# Altium schematic sheet 28Pins_schematic.SchDoc (part 2 of 2)
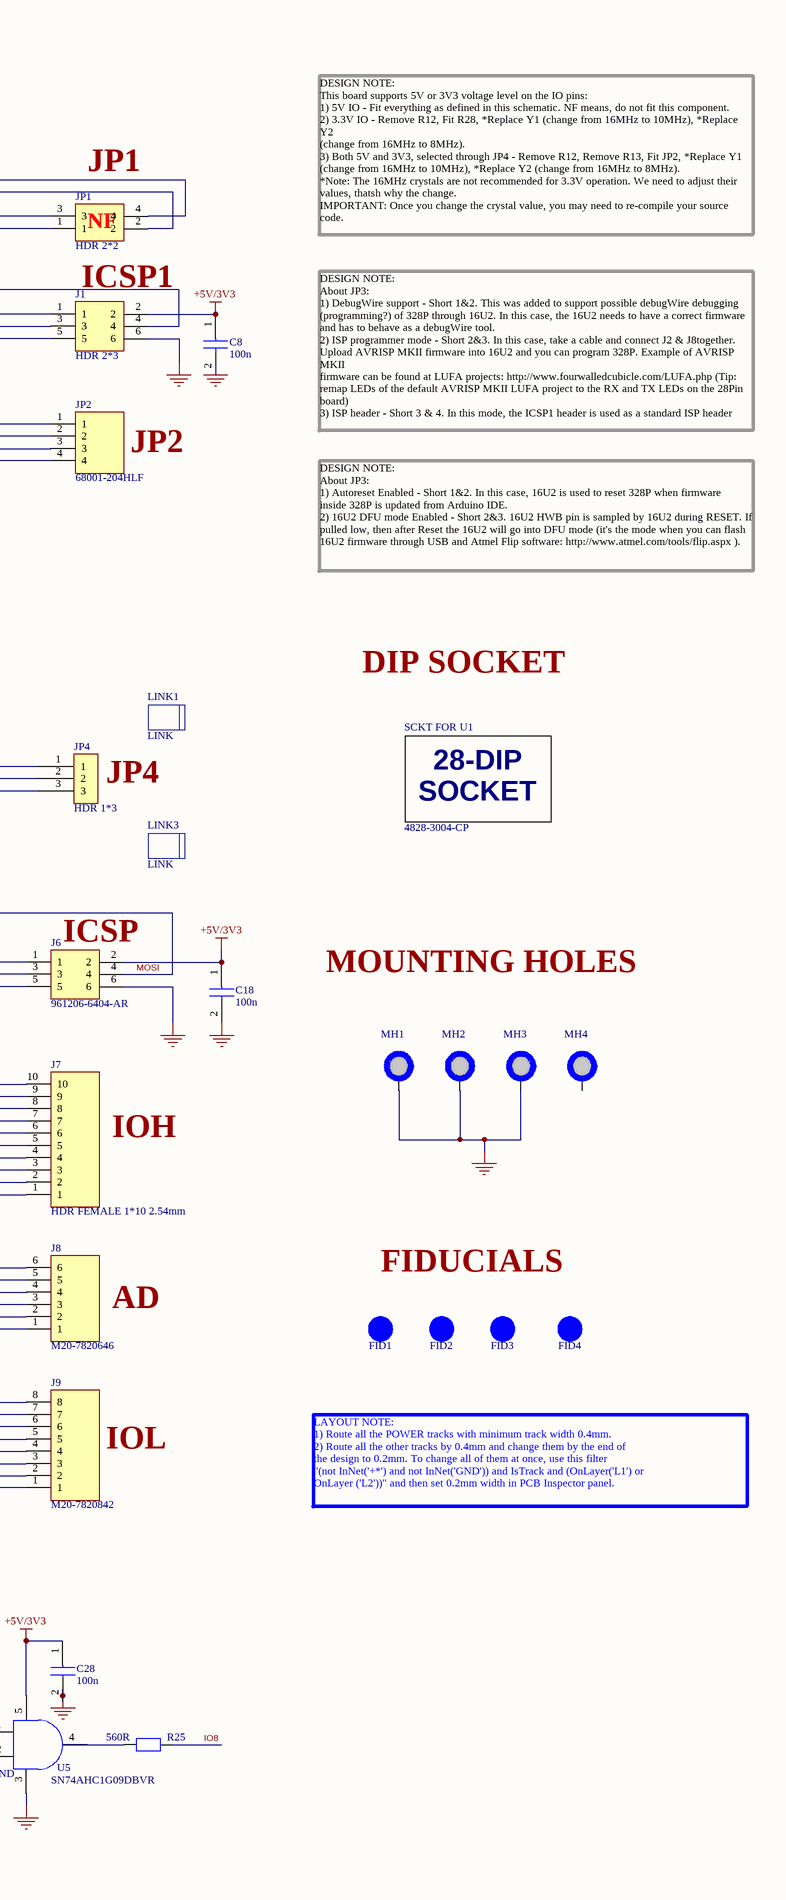
[diagram p2: 28Pins_schematic.SchDoc, right]

## Library data of the parts
C1 C15-C17 C19 C21 C22 = C2012X5R1C106M125AC: 10 µF ±20% 16V Ceramic Capacitor X5R 0805 (2012 Metric); Manufacturer_Name: TDK; Datasheet Link: https://product.tdk.com/info/en/catalog/datasheets/mlcc_commercial_midvoltage_en.pdf; Height: 1.45mm; Manufacturer_Part_Number: C2012X5R1C106M125AC; Mouser Part Number: 810-C2012X5R1C106M-3; Mouser Price/Stock: https://www.mouser.co.uk/ProductDetail/TDK/C2012X5R1C106M125AC?qs=LcTL%2F5vFEzHcq9TBdtOIgw%3D%3D
C2-C4 C8 C11-C14 C18 C20 C23-C25 C28-C33 = C2012X7R1H104K_085AA_: Capacitor; Manufacturer_Name: TDK; Manufacturer_Part_Number: C2012X7R1H104K(085AA); Datasheet Link: https://product.tdk.com/info/en/catalog/datasheets/mlcc_commercial_midvoltage_en.pdf; Height: 1.45mm
C5 = C2012X5R1E105K125AA: C Series 0805 1 uF 25 V ±10% Tolerance X5R SMT Multilayer Ceramic Capacitor; Manufacturer: TDK; Manufacturer Lifecycle Status: PRODUCTION; Capacitance: 1µF; Voltage: 25V; Supplier 1: DigiKey; Manufacturer Part Number: C2012X5R1E105K125AA; RoHS: Compliant; Category: Ceramic Capacitors; Stock 1: 10349; Pricing 1: 1=0.19, 10=0.106, 50=0.0756, 100=0.0662, 500=0.05034, 1000=0.04546 (USD); Case/Package: 0805; Case Code (Imperial): 0805; Case Code (Metric): 2012; China RoHS: Compliant; Composition: Ceramic; Depth: 1.25mm; Dielectric: X5R; Dielectric Material: Ceramic; Height: 1.25mm; Lead Free: Lead Free; Length: 2mm; Lifecycle Status: Production; Material: Ceramic; Max Length: 2.2mm; Max Operating Temperature: 85°C; Max Width: 1.45mm; Min Length: 1.8mm; Min Operating Temperature: -55°C; Min Width: 1.05mm; Mount: Surface Mount; Number of Pins: 2; Number of Terminals: 2; Radiation Hardening: No; REACH SVHC: Yes; Schedule B: 8532240020, 8532240020|8532240020, 8532240020|8532240020|8532240020, 8532240020|8532240020|8532240020|8532240020; Termination: SMD/SMT; Tolerance: 10%; Voltage Rating: 25V; Voltage Rating (DC): 25V; Weight: 5.499807mg; Width: 1.25mm; ComponentLink1URL: https://datasheet.octopart.com:443/C2012X5R1E105K125AA-TDK-datasheet-175423548.pdf?src-supplier=TME; ComponentLink1Description: https://datasheet.octopart.com:443/C2012X5R1E105K125AA-TDK-datasheet-175423548.pdf?src-supplier=TME; ComponentLink2URL: https://datasheet.octopart.com:443/C2012X5R1E105K125AA-TDK-datasheet-182135025.pdf?src-supplier=TME; ComponentLink2Description: https://datasheet.octopart.com:443/C2012X5R1E105K125AA-TDK-datasheet-182135025.pdf?src-supplier=TME; ComponentLink3URL: https://datasheet.octopart.com:443/C2012X5R1E105K125AA-TDK-datasheet-159617022.pdf?src-supplier=TME; ComponentLink3Description: https://datasheet.octopart.com:443/C2012X5R1E105K125AA-TDK-datasheet-159617022.pdf?src-supplier=TME; ComponentLink4URL: https://datasheet.octopart.com:443/C2012X5R1E105K125AA-TDK-datasheet-151546523.pdf?src-supplier=TDK; ComponentLink4Description: https://datasheet.octopart.com:443/C2012X5R1E105K125AA-TDK-datasheet-151546523.pdf?src-supplier=TDK; ComponentLink5URL: https://datasheet.octopart.com/C2012X5R1E105K125AA-TDK-datasheet-41194876.pdf; ComponentLink5Description: https://datasheet.octopart.com/C2012X5R1E105K125AA-TDK-datasheet-41194876.pdf; ComponentLink6URL: https://datasheet.octopart.com:443/C2012X5R1E105K125AA-TDK-datasheet-20681607.pdf?src-supplier=Newark; ComponentLink6Description: https://datasheet.octopart.com:443/C2012X5R1E105K125AA-TDK-datasheet-20681607.pdf?src-supplier=Newark; ComponentLink7URL: https://datasheet.octopart.com:443/C2012X5R1E105K125AA-TDK-datasheet-82475248.pdf?src-supplier=Newark; ComponentLink7Description: https://datasheet.octopart.com:443/C2012X5R1E105K125AA-TDK-datasheet-82475248.pdf?src-supplier=Newark; ComponentLink8URL: https://datasheet.octopart.com:443/C2012X5R1E105K125AA-TDK-datasheet-8852320.pdf?src-supplier=Newark; ComponentLink8Description: https://datasheet.octopart.com:443/C2012X5R1E105K125AA-TDK-datasheet-8852320.pdf?src-supplier=Newark; ComponentLink9URL: https://datasheet.octopart.com:443/C2012X5R1E105K125AA-TDK-datasheet-13376850.pdf?src-supplier=Newark; ComponentLink9Description: https://datasheet.octopart.com:443/C2012X5R1E105K125AA-TDK-datasheet-13376850.pdf?src-supplier=Newark; ComponentLink10URL: https://datasheet.octopart.com:443/C2012X5R1E105K125AA-TDK-datasheet-10921857.pdf?src-supplier=element14+APAC; ComponentLink10Description: https://datasheet.octopart.com:443/C2012X5R1E105K125AA-TDK-datasheet-10921857.pdf?src-supplier=element14+APAC; ComponentLink11URL: https://datasheet.octopart.com:443/C2012X5R1E105K125AA-TDK-datasheet-12509848.pdf?src-supplier=Future+Electronics; ComponentLink11Description: https://datasheet.octopart.com:443/C2012X5R1E105K125AA-TDK-datasheet-12509848.pdf?src-supplier=Future+Electronics; ComponentLink12URL: https://datasheet.octopart.com:443/C2012X5R1E105K125AA-TDK-datasheet-10978788.pdf?src-supplier=Future+Electronics; ComponentLink12Description: https://datasheet.octopart.com:443/C2012X5R1E105K125AA-TDK-datasheet-10978788.pdf?src-supplier=Future+Electronics; ComponentLink13URL: https://datasheet.octopart.com:443/C2012X5R1E105K125AA-TDK-datasheet-8359770.pdf?src-supplier=Future+Electronics; ComponentLink13Description: https://datasheet.octopart.com:443/C2012X5R1E105K125AA-TDK-datasheet-8359770.pdf?src-supplier=Future+Electronics; ComponentLink14URL: https://datasheet.octopart.com:443/C2012X5R1E105K125AA-TDK-datasheet-8324322.pdf?src-supplier=Future+Electronics; ComponentLink14Description: https://datasheet.octopart.com:443/C2012X5R1E105K125AA-TDK-datasheet-8324322.pdf?src-supplier=Future+Electronics; ComponentLink15URL: https://datasheet.octopart.com:443/C2012X5R1E105K125AA-TDK-datasheet-128946.pdf?src-supplier=Future+Electronics; ComponentLink15Description: https://datasheet.octopart.com:443/C2012X5R1E105K125AA-TDK-datasheet-128946.pdf?src-supplier=Future+Electronics; Supplier Part Number 1: 445-1419-1-ND
C6 C7 = EEE-1AA101WR: Radial Can - SMD ALUMINUM ELECTROLYTIC CAPACITOR S 10V 100muF ±20% 0.197Dia 5.00mm; Manufacturer_Name: Panasonic; Datasheet Link: http://industrial.panasonic.com/cdbs/www-data/pdf/RDE0000/ABA0000C1145.pdf; Height: 6.5mm; Manufacturer_Part_Number: EEE-1AA101WR; Mouser Part Number: 667-EEE-1AA101WR; Mouser Price/Stock: https://www.mouser.co.uk/ProductDetail/Panasonic/EEE-1AA101WR?qs=ANJC8C65Mw69l04MNJ%252BCMg%3D%3D; Arrow Part Number: EEE-1AA101WR; Arrow Price/Stock: https://www.arrow.com/en/products/eee-1aa101wr/panasonic?utm_currency=USD&region=europe
C9 C10 C26 C27 = C0805C180J5GAC-TU: SMD Comm C0G 0805 (2012Metric) Ceramic Capacitor 0.079Lx0.049W 2.00mmx1.25mm C0G NP0 ±5% 18pF; Manufacturer_Name: KEMET; Datasheet Link: https://connect.kemet.com:7667/gateway/IntelliData-ComponentDocumentation/1.0/download/specsheet/C0805C180J5GACTU; Height: 0.88mm; Manufacturer_Part_Number: C0805C180J5GAC-TU; Arrow Part Number: C0805C180J5GAC-TU; Arrow Price/Stock: https://www.arrow.com/en/products/c0805c180j5gactu/kemet-corporation
D1 D2 = BAT54HT1G: DIODE SCHOTTKY 30V 200MA SOD323; Manufacturer_Name: onsemi; Datasheet Link: https://www.onsemi.com/pub/Collateral/BAT54HT1-D.PDF; Height: 1.1mm; Manufacturer_Part_Number: BAT54HT1G; Mouser Part Number: 863-BAT54HT1G; Mouser Price/Stock: https://www.mouser.co.uk/ProductDetail/onsemi/BAT54HT1G?qs=vLkC5FC1VN%252BK3ZQA%252ByHPIA%3D%3D; Arrow Part Number: BAT54HT1G; Arrow Price/Stock: https://www.arrow.com/en/products/bat54ht1g/on-semiconductor?utm_currency=USD&region=europe
FB1-FB3 = MPZ2012S601AT000: FERRITE BEAD 600 OHM 0805 1LN; Manufacturer_Name: TDK; Datasheet Link: https://product.tdk.com/system/files/dam/doc/product/emc/emc/beads/catalog/beads_commercial_power_mpz2012_en.pdf; Height: 1.05mm; Manufacturer_Part_Number: MPZ2012S601AT000; Mouser Part Number: 810-MPZ2012S601AT000; Mouser Price/Stock: https://www.mouser.co.uk/ProductDetail/TDK/MPZ2012S601AT000?qs=8Kz9Wu9QwqXtNFDW9LJXAQ%3D%3D; Arrow Part Number: MPZ2012S601AT000; Arrow Price/Stock: https://www.arrow.com/en/products/mpz2012s601at000/tdk?region=nac
FID1-FID4 = FID_1MMC: Fiducial 40mil Diameter,120mil Mask.
J1 J6 = 961206-6404-AR: Connector; Manufacturer_Name: 3M; Datasheet Link: https://datasheet.datasheetarchive.com/originals/distributors/Datasheets-DGA21/2082015.pdf; Height: 11.3mm; Manufacturer_Part_Number: 961206-6404-AR; Mouser Part Number: 517-9612066404AR; Mouser Price/Stock: https://www.mouser.co.uk/ProductDetail/3M-Electronic-Solutions-Division/961206-6404-AR?qs=A%252BtsDZJT%252Bi%2Ft%2F4aaelvU3g%3D%3D
J2 = 10118193-0001LF: USB - micro B USB 2.0 Receptacle Connector 5 Position Surface Mount, Right Angle, Horizontal; Manufacturer_Name: Amphenol Communications Solutions; Datasheet Link: https://cdn.amphenol-cs.com/media/wysiwyg/files/drawing/10118193.pdf; Height: 3.3mm; Manufacturer_Part_Number: 10118193-0001LF; Arrow Part Number: 10118193-0001LF; Arrow Price/Stock: https://www.arrow.com/en/products/10118193-0001lf/amphenol-fci?utm_currency=USD&region=europe
J3 J4 = PAD_WITH_HOLE_4MMX1.5MM
J5 J9 = M20-7820842: Connector; Manufacturer_Name: Harwin; Datasheet Link: https://cdn.harwin.com/pdfs/M20-782.pdf; Height: 8.5mm; Manufacturer_Part_Number: M20-7820842; Mouser Part Number: 855-M20-7820842; Mouser Price/Stock: https://www.mouser.co.uk/ProductDetail/Harwin/M20-7820842?qs=WS5Jv%252B%252Bx1qXOep0XOTvy2Q%3D%3D
J7 = M20-7821046: Connector; Manufacturer_Name: Harwin; Datasheet Link: https://cdn.harwin.com/pdfs/M20-782.pdf; Height: 8.65mm; Manufacturer_Part_Number: M20-7821046; Mouser Part Number: 855-M20-7821046; Mouser Price/Stock: https://www.mouser.co.uk/ProductDetail/Harwin/M20-7821046?qs=Jph8NoUxIfXTsFl0wvOA6g%3D%3D
J8 = M20-7820646: 6 Position Receptacle Connector 0.100" (2.54mm) Through Hole Tin; Manufacturer_Name: Harwin; Datasheet Link: https://cdn.harwin.com/pdfs/M20-782.pdf; Height: 8.65mm; Manufacturer_Part_Number: M20-7820646; Mouser Part Number: 855-M20-7820646; Mouser Price/Stock: https://www.mouser.co.uk/ProductDetail/Harwin/M20-7820646?qs=WS5Jv%252B%252Bx1qWZs4rbTjPGWw%3D%3D
JP1 = 68602-204HLF: Connector; Manufacturer_Name: Amphenol; Datasheet Link: https://cdn.amphenol-icc.com/media/wysiwyg/files/drawing/67996.pdf; Height: 8.88mm; Manufacturer_Part_Number: 68602-204HLF; Mouser Part Number: 649-68602-204HLF; Mouser Price/Stock: https://www.mouser.co.uk/ProductDetail/Amphenol-FCI/68602-204HLF?qs=CEgdKq8q45VwVPnJk6o7tQ%3D%3D; Arrow Part Number: 68602-204HLF; Arrow Price/Stock: https://www.arrow.com/en/products/68602-204hlf/amphenol-fci?region=nac
JP2 = 68001-204HLF: Connector; Manufacturer_Name: Amphenol Communications Solutions; Datasheet Link: https://cdn.amphenol-cs.com/media/wysiwyg/files/drawing/68000.pdf; Height: 8.58mm; Manufacturer_Part_Number: 68001-204HLF
JP3 JP4 = 68000-103HLF: Pin Header, Board-to-Board, 2.54 mm, 1 Rows, 3 Contacts, Through Hole, FCI BergStik II 68000; Manufacturer: Amphenol Communications Solutions; Connector Type: Male Pin; Current Rating: 3A; Dielectric Material: Polyethylene; Gender: Male; Insulation Resistance: 5GΩ; Lead Length: 2.41mm; Mating Post Length: 5.84mm; Max Voltage Rating (AC): 1.5kV; Number of Contacts: 3; Pitch: 2.54mm; Plating Thickness: 762nm; Voltage Rating: 1.05kV; Supplier 1: DigiKey; Manufacturer Part Number: 68000-103HLF; RoHS: Compliant; Category: Headers and Wire Housings; Stock 1: 64893; Pricing 1: 1=0.31, 10=0.266, 100=0.2257, 500=0.20142, 4000=0.17391, 8000=0.1656, 12000=0.16093 (USD); China RoHS: Compliant; Color: Black; Contact Gender: Male; Contact Material: Gold; Contact Mating Length: 5.842mm; Contact Plating: Gold; Depth: 2.41mm; Flammability Rating: UL94 V-0; Height: 8.73mm; Housing Color: Black; Housing Material: Thermoplastic; Lead Pitch: 2.54mm; Length: 7.62mm; Lifecycle Status: Production; Max Operating Temperature: 125°C; Min Operating Temperature: -65°C; Mount: Through Hole; Number of Pins: 3; Number of Positions: 3; Number of Rows: 1; Orientation: Straight; Packaging: Bulk; Radiation Hardening: No; REACH SVHC: Yes; Terminal Pitch: 2.54mm; Termination: Solder; ComponentLink1URL: https://datasheet.octopart.com:443/68000-103HLF-Amphenol-ICC---FCI-datasheet-155511504.pdf?src-supplier=Upverter; ComponentLink1Description: https://datasheet.octopart.com:443/68000-103HLF-Amphenol-ICC---FCI-datasheet-155511504.pdf?src-supplier=Upverter; ComponentLink2URL: https://datasheet.octopart.com:443/68000-103HLF-Amphenol-Communications-Solutions-datasheet-10088795.pdf?src-supplier=Farnell; ComponentLink2Description: https://datasheet.octopart.com:443/68000-103HLF-Amphenol-Communications-Solutions-datasheet-10088795.pdf?src-supplier=Farnell; ComponentLink3URL: https://datasheet.octopart.com:443/68000-103HLF-Amphenol-Communications-Solutions-datasheet-41232361.pdf?src-supplier=Farnell; ComponentLink3Description: https://datasheet.octopart.com:443/68000-103HLF-Amphenol-Communications-Solutions-datasheet-41232361.pdf?src-supplier=Farnell; ComponentLink4URL: https://datasheet.octopart.com:443/68000-103HLF-Areva-datasheet-8861575.pdf?src-supplier=Newark; ComponentLink4Description: https://datasheet.octopart.com:443/68000-103HLF-Areva-datasheet-8861575.pdf?src-supplier=Newark; ComponentLink5URL: https://datasheet.octopart.com:443/68000-103HLF-Areva-datasheet-8713716.pdf?src-supplier=Newark; ComponentLink5Description: https://datasheet.octopart.com:443/68000-103HLF-Areva-datasheet-8713716.pdf?src-supplier=Newark; ComponentLink6URL: https://datasheet.octopart.com:443/68000-103HLF-Areva-datasheet-8449737.pdf?src-supplier=Newark; ComponentLink6Description: https://datasheet.octopart.com:443/68000-103HLF-Areva-datasheet-8449737.pdf?src-supplier=Newark; ComponentLink7URL: https://datasheet.octopart.com:443/68000-103HLF-Amphenol-Communications-Solutions-datasheet-154727322.pdf?src-supplier=Electro+Sonic; ComponentLink7Description: https://datasheet.octopart.com:443/68000-103HLF-Amphenol-Communications-Solutions-datasheet-154727322.pdf?src-supplier=Electro+Sonic; ComponentLink8URL: https://datasheet.octopart.com:443/68000-103HLF-Amphenol-Communications-Solutions-datasheet-100449246.pdf?src-supplier=TME; ComponentLink8Description: https://datasheet.octopart.com:443/68000-103HLF-Amphenol-Communications-Solutions-datasheet-100449246.pdf?src-supplier=TME; ComponentLink9URL: https://datasheet.octopart.com:443/68000-103HLF-Amphenol-datasheet-170317325.pdf?src-supplier=Amar+Radio+Corporation; ComponentLink9Description: https://datasheet.octopart.com:443/68000-103HLF-Amphenol-datasheet-170317325.pdf?src-supplier=Amar+Radio+Corporation; ComponentLink10URL: https://datasheet.octopart.com:443/68000-103HLF-Amphenol-Communications-Solutions-datasheet-13448982.pdf?src-supplier=RS+(Formerly+Allied+Electronics); ComponentLink10Description: https://datasheet.octopart.com:443/68000-103HLF-Amphenol-Communications-Solutions-datasheet-13448982.pdf?src-supplier=RS+(Formerly+Allied+Electronics); Supplier Part Number 1: 609-3461-ND
L1 = L1210R2R2MDWIT: FIXED IND 2.2UH 2A 80 MOHM SMD; Manufacturer_Name: KEMET; Datasheet Link: https://content.kemet.com/datasheets/KEM_L9015_L-DWI.pdf; Height: 2.7mm; Manufacturer_Part_Number: L1210R2R2MDWIT; Mouser Part Number: 80-L1210R2R2MDWIT; Mouser Price/Stock: https://www.mouser.co.uk/ProductDetail/KEMET/L1210R2R2MDWIT?qs=v1sh8PPj49i7zaK1i33Fzg%3D%3D; Arrow Part Number: L1210R2R2MDWIT; Arrow Price/Stock: https://www.arrow.com/en/products/l1210r2r2mdwit/kemet-corporation?region=nac
LED1 LED2 = LO_L29K-H2K1-24-Z: LED; Manufacturer_Name: ams OSRAM; Manufacturer_Part_Number: LO L29K-H2K1-24-Z; Datasheet Link: https://datasheet.datasheetarchive.com/originals/distributors/DKDS41/DSANUWW0036666.pdf; Height: 0.67mm; Mouser Part Number: 720-LOL29KH2K124Z; Mouser Price/Stock: https://www.mouser.com/Search/Refine.aspx?Keyword=720-LOL29KH2K124Z; Arrow Part Number: LO L29K-H2K1-24-Z; Arrow Price/Stock: https://www.arrow.com/en/products/lol29k-h2k1-24-z/osram-opto-semiconductors
LED3 = Orange: LED ORANGE DIFFUSED 0603 SMD; Manufacturer_Name: ams OSRAM; Manufacturer_Part_Number: LO L29K-H2K1-24-Z; Datasheet Link: https://datasheet.datasheetarchive.com/originals/distributors/DKDS41/DSANUWW0036666.pdf; Height: 0.67mm; Mouser Part Number: 720-LOL29KH2K124Z; Mouser Price/Stock: https://www.mouser.com/Search/Refine.aspx?Keyword=720-LOL29KH2K124Z; Arrow Part Number: LO L29K-H2K1-24-Z; Arrow Price/Stock: https://www.arrow.com/en/products/lol29k-h2k1-24-z/osram-opto-semiconductors
LED4 = LG_L29K-G2J1-24-Z: LED; Manufacturer_Name: ams OSRAM; Manufacturer_Part_Number: LG L29K-G2J1-24-Z; Datasheet Link: https://www.digikey.ph/en/products/detail/ams-osram-usa-inc/LG-L29K-G2J1-24-Z/1938740?msockid=39f1ec84d77b6f4428b7f904d6676eed; Height: 0.67mm; Mouser Part Number: 720-LGL29KG2J124Z; Mouser Price/Stock: https://www.mouser.co.uk/ProductDetail/OSRAM-Opto-Semiconductors/LG-L29K-G2J1-24-Z?qs=nTDll3UaDK6NQ6lyL9BooQ%3D%3D; Arrow Part Number: LG L29K-G2J1-24-Z; Arrow Price/Stock: https://www.arrow.com/en/products/lgl29k-g2j1-24-z/osram-opto-semiconductors?region=nac
LINK1-LINK3 = QPC02SXGN-RC: 2 Position 2.54 mm Centerline Single Circuit Open Top Jumper; Manufacturer: Sullins; Current Rating: 3A; Number of Contacts: 2; Pitch: 2.54mm; Supplier 1: DigiKey; Manufacturer Part Number: QPC02SXGN-RC; RoHS: Compliant; Category: Connectors; Stock 1: 1109394; Pricing 1: 1=0.1, 10=0.025, 25=0.0236, 50=0.0224, 100=0.0213, 250=0.02, 500=0.01904, 2000=0.01726, 4000=0.01644 (USD); Case/Package: 100; Contact Gender: Female; Contact Material: Brass; Contact Plating: Gold; Height: 6.17mm; Lead Free: Lead Free; Lifecycle Status: Production; Max Operating Temperature: 85°C; Min Operating Temperature: -40°C; Number of Pins: 1; Number of Positions: 2; Packaging: Bulk; REACH SVHC: Yes; ComponentLink1URL: https://datasheet.octopart.com:443/QPC02SXGN-RC-Sullins-datasheet-138898435.pdf?src-supplier=ODG+(Origin+Data+Global); ComponentLink1Description: https://datasheet.octopart.com:443/QPC02SXGN-RC-Sullins-datasheet-138898435.pdf?src-supplier=ODG+(Origin+Data+Global); ComponentLink2URL: https://datasheet.octopart.com:443/QPC02SXGN-RC-Sullins-datasheet-12521006.pdf?src-supplier=IHS; ComponentLink2Description: https://datasheet.octopart.com:443/QPC02SXGN-RC-Sullins-datasheet-12521006.pdf?src-supplier=IHS; ComponentLink3URL: https://sigma.octopart.com:443/138898456/technical_drawing/Sullins-QPC02SXGN-RC.pdf?src-supplier=Upverter; ComponentLink3Description: https://sigma.octopart.com:443/138898456/technical_drawing/Sullins-QPC02SXGN-RC.pdf?src-supplier=Upverter; ComponentLink4URL: https://datasheet.octopart.com:443/QPC02SXGN-RC-Sullins-datasheet-41399305.pdf?src-supplier=Future+Electronics; ComponentLink4Description: https://datasheet.octopart.com:443/QPC02SXGN-RC-Sullins-datasheet-41399305.pdf?src-supplier=Future+Electronics; Supplier Part Number 1: S9337-ND
MH1-MH3 = MH_7.4MMC_3.2MMD: Mounting hole 7.4mm Diameter,3.2mm drill
MH4 = MH_7.4MMNC_3.2MMD: Hole 7.4mm Diameter(Non Copper),3.2mm drill NPTH
R1 = 100K: RES 100K OHM 1% 1/8W 0805; Manufacturer_Name: YAGEO; Manufacturer_Part_Number: RC0805FR-07100KL; Datasheet Link: https://4donline.ihs.com/images/VipMasterIC/IC/YAGO/YAGO-S-A0010774850/YAGO-S-A0010774850-1.pdf?hkey=6D3A4C79FDBF58556ACFDE234799DDF0; Height: 0.6mm; Mouser Part Number: 603-RC0805FR-07100KL; Mouser Price/Stock: https://www.mouser.co.uk/ProductDetail/YAGEO/RC0805FR-07100KL?qs=8Y8p%252BasKcI7rEWn6FcVdAA%3D%3D; Arrow Part Number: RC0805FR-07100KL; Arrow Price/Stock: https://www.arrow.com/en/products/rc0805fr-07100kl/yageo?region=europe
R2 R3 R18 = RC0805FR-07560RL: Res Thick Film 0805 560 Ohm 1% 0.125W(1/8W) ±100ppm/C Pad SMD T/R; Manufacturer_Name: KEMET; Datasheet Link: http://www.yageo.com/documents/recent/PYu-RC_Group_51_RoHS_L_10.pdf; Height: 0.6mm; Manufacturer_Part_Number: RC0805FR-07560RL; Mouser Part Number: 603-RC0805FR-07560RL; Mouser Price/Stock: https://www.mouser.co.uk/ProductDetail/YAGEO/RC0805FR-07560RL?qs=g6xwsc4j%252B%2Foqaguphwrcog%3D%3D; Arrow Part Number: RC0805FR-07560RL; Arrow Price/Stock: https://www.arrow.com/en/products/rc0805fr-07560rl/yageo?region=nac
R4 = 0R: Resistor; Manufacturer_Name: YAGEO; Manufacturer_Part_Number: RC0805JR-070RL; Datasheet Link: https://www.yageo.com/upload/media/product/productsearch/datasheet/rchip/PYu-RC_Group_51_RoHS_L_12.pdf; Height: 0.6mm; Mouser Part Number: 603-RC0805JR-070RL; Mouser Price/Stock: https://www.mouser.co.uk/ProductDetail/YAGEO/RC0805JR-070RL?qs=3ldFlDWnkKyEhdaPjQHEFA%3D%3D; Arrow Part Number: RC0805JR-070RL; Arrow Price/Stock: https://www.arrow.com/en/products/rc0805jr-070rl/yageo?utm_currency=USD&region=europe
R5 R19 R21-R24 = 10K: RES 10K OHM 1% 1/8W 0805; Manufacturer_Name: YAGEO; Manufacturer_Part_Number: RC0805FR-0710KL; Datasheet Link: https://www.yageo.com/upload/media/product/productsearch/datasheet/rchip/PYu-RC_Group_51_RoHS_L_11.pdf; Height: 0.6mm; Mouser Part Number: 603-RC0805FR-0710KL; Mouser Price/Stock: https://www.mouser.co.uk/ProductDetail/YAGEO/RC0805FR-0710KL?qs=7bY8808IzHq6vrU3BeiiYw%3D%3D; Arrow Part Number: RC0805FR-0710KL; Arrow Price/Stock: https://www.arrow.com/en/products/rc0805fr-0710kl/yageo?utm_currency=USD&region=europe
R6-R8 R16 R26-R28 = RC0805FR-0722RL: 125mW Thick Film Resistors 150V ±100ppm/℃ ±1% 22Ω 0805 Chip Resistor - Surface Mount ROHS; Manufacturer: Yageo Group; Temperature Coefficient: 100ppm/°C; Height: 500µm; Supplier 1: DigiKey; Manufacturer Part Number: RC0805FR-0722RL; RoHS: Compliant; Category: Chip SMD Resistors; Stock 1: 71349; Pricing 1: 1=0.1, 10=0.008, 25=0.0076, 50=0.0072 (USD); Case/Package: 0805; Case Code (Imperial): 0805; China RoHS: Non-Compliant; Composition: Thick Film; Depth: 1.25mm; Features: Moisture Resistant; Lead Free: Lead Free; Length: 2.0066mm; Lifecycle Status: Production; Max Operating Temperature: 155°C; Max Power Dissipation: 125mW; Military Standard: Not; Min Operating Temperature: -55°C; Mount: Surface Mount; Number of Pins: 2; Number of Terminals: 2; Number of Terminations: 2; Packaging: Tape & Reel; Power Dissipation: 125mW; Power Rating: 125mW; REACH SVHC: Yes; Resistance: 22Ω; Schedule B: 8533210045, 8533210045|8533210045, 8533210045|8533210045|8533210045, 8533210045|8533210045|8533210045|8533210045; Termination: SMD/SMT; Tolerance: 1%; Voltage Rating: 150V; Voltage Rating (AC): 150V; Voltage Rating (DC): 150V; Width: 1.25mm; Working Voltage: 150V; ComponentLink1URL: https://datasheet.octopart.com:443/RC0805FR-0722RL-Yageo-datasheet-175887523.pdf?src-supplier=IHS; ComponentLink1Description: https://datasheet.octopart.com:443/RC0805FR-0722RL-Yageo-datasheet-175887523.pdf?src-supplier=IHS; ComponentLink2URL: https://datasheet.octopart.com:443/RC0805FR-0722RL-Yageo-datasheet-103092701.pdf?src-supplier=Upverter; ComponentLink2Description: https://datasheet.octopart.com:443/RC0805FR-0722RL-Yageo-datasheet-103092701.pdf?src-supplier=Upverter; ComponentLink3URL: https://datasheet.octopart.com:443/RC0805FR-0722RL-Yageo-datasheet-79472498.pdf?src-supplier=Upverter; ComponentLink3Description: https://datasheet.octopart.com:443/RC0805FR-0722RL-Yageo-datasheet-79472498.pdf?src-supplier=Upverter; ComponentLink4URL: https://datasheet.octopart.com:443/RC0805FR-0722RL-Yageo-datasheet-8330313.pdf?src-supplier=element14+APAC; ComponentLink4Description: https://datasheet.octopart.com:443/RC0805FR-0722RL-Yageo-datasheet-8330313.pdf?src-supplier=element14+APAC; ComponentLink5URL: https://datasheet.octopart.com:443/RC0805FR-0722RL-Yageo-datasheet-62067350.pdf?src-supplier=element14+APAC; ComponentLink5Description: https://datasheet.octopart.com:443/RC0805FR-0722RL-Yageo-datasheet-62067350.pdf?src-supplier=element14+APAC; ComponentLink6URL: https://datasheet.octopart.com:443/RC0805FR-0722RL-Yageo-datasheet-164759695.pdf?src-supplier=Future+Electronics; ComponentLink6Description: https://datasheet.octopart.com:443/RC0805FR-0722RL-Yageo-datasheet-164759695.pdf?src-supplier=Future+Electronics; ComponentLink7URL: https://datasheet.octopart.com:443/RC0805FR-0722RL-Yageo-datasheet-12592811.pdf?src-supplier=Future+Electronics; ComponentLink7Description: https://datasheet.octopart.com:443/RC0805FR-0722RL-Yageo-datasheet-12592811.pdf?src-supplier=Future+Electronics; ComponentLink8URL: https://datasheet.octopart.com:443/RC0805FR-0722RL-Yageo-datasheet-8324252.pdf?src-supplier=Future+Electronics; ComponentLink8Description: https://datasheet.octopart.com:443/RC0805FR-0722RL-Yageo-datasheet-8324252.pdf?src-supplier=Future+Electronics; ComponentLink9URL: https://datasheet.octopart.com/RC0805FR-0722RL-Yageo-datasheet-73766026.pdf; ComponentLink9Description: https://datasheet.octopart.com/RC0805FR-0722RL-Yageo-datasheet-73766026.pdf; ComponentLink10URL: https://datasheet.octopart.com:443/RC0805FR-0722RL-Yageo-datasheet-13691069.pdf?src-supplier=Farnell; ComponentLink10Description: https://datasheet.octopart.com:443/RC0805FR-0722RL-Yageo-datasheet-13691069.pdf?src-supplier=Farnell; ComponentLink11URL: https://datasheet.octopart.com:443/RC0805FR-0722RL-Yageo-datasheet-118657.pdf?src-supplier=DigiKey; ComponentLink11Description: https://datasheet.octopart.com:443/RC0805FR-0722RL-Yageo-datasheet-118657.pdf?src-supplier=DigiKey; ComponentLink12URL: http://sigma.octopart.com:80/rohs_statement/Yageo-company-2.pdf?src-supplier=Compliance+Statements; ComponentLink12Description: http://sigma.octopart.com:80/rohs_statement/Yageo-company-2.pdf?src-supplier=Compliance+Statements; ComponentLink13URL: http://sigma.octopart.com:80/conflict_mineral_statement/Yageo-company-3.pdf?src-supplier=Compliance+Statements; ComponentLink13Description: http://sigma.octopart.com:80/conflict_mineral_statement/Yageo-company-3.pdf?src-supplier=Compliance+Statements; Supplier Part Number 1: 311-22.0CRCT-ND
R9 R13 R14 = RC0805JR-070RL: GENERAL PURPOSE CHIP RESISTOR Metal Glaze/thick Film, 0.125W, 0ohm, Surface Mount, 0805; Manufacturer_Name: YAGEO; Datasheet Link: https://www.yageo.com/upload/media/product/productsearch/datasheet/rchip/PYu-RC_Group_51_RoHS_L_12.pdf; Height: 0.6mm; Manufacturer_Part_Number: RC0805JR-070RL; Mouser Part Number: 603-RC0805JR-070RL; Mouser Price/Stock: https://www.mouser.co.uk/ProductDetail/YAGEO/RC0805JR-070RL?qs=3ldFlDWnkKyEhdaPjQHEFA%3D%3D; Arrow Part Number: RC0805JR-070RL; Arrow Price/Stock: https://www.arrow.com/en/products/rc0805jr-070rl/yageo?utm_currency=USD&region=europe
R10 R20 = 1M: RES SMD 1M OHM 1% 1/8W 0805; Manufacturer_Name: YAGEO; Manufacturer_Part_Number: RC0805FR-071ML; Datasheet Link: https://www.yageo.com/upload/media/product/productsearch/datasheet/rchip/PYu-RC_Group_51_RoHS_L_11.pdf; Height: 0.6mm; Mouser Part Number: 603-RC0805FR-071ML; Mouser Price/Stock: https://www.mouser.co.uk/ProductDetail/YAGEO/RC0805FR-071ML?qs=8Y8p%252BasKcI6wvSL4jxV1pQ%3D%3D; Arrow Part Number: RC0805FR-071ML; Arrow Price/Stock: https://www.arrow.com/en/products/rc0805fr-071ml/yageo?region=europe
R11 R12 R15 = 1K: RES 1K OHM 1% 1/8W 0805; Manufacturer_Name: YAGEO; Manufacturer_Part_Number: RC0805FR-071KL; Datasheet Link: https://www.yageo.com/upload/media/product/productsearch/datasheet/rchip/PYu-RC_Group_51_RoHS_L_11.pdf; Height: 0.6mm; Mouser Part Number: 603-RC0805FR-071KL; Mouser Price/Stock: https://www.mouser.co.uk/ProductDetail/YAGEO/RC0805FR-071KL?qs=1ogmaHw32WJjeGY0DHXakQ%3D%3D; Arrow Part Number: RC0805FR-071KL; Arrow Price/Stock: https://www.arrow.com/en/products/rc0805fr-071kl/yageo?utm_currency=USD&region=europe
R17 R25 = 560 Ohm: Resistor; Manufacturer_Name: KEMET; Manufacturer_Part_Number: RC0805FR-07560RL; Datasheet Link: http://www.yageo.com/documents/recent/PYu-RC_Group_51_RoHS_L_10.pdf; Height: 0.6mm; Mouser Part Number: 603-RC0805FR-07560RL; Mouser Price/Stock: https://www.mouser.co.uk/ProductDetail/YAGEO/RC0805FR-07560RL?qs=g6xwsc4j%252B%2Foqaguphwrcog%3D%3D; Arrow Part Number: RC0805FR-07560RL; Arrow Price/Stock: https://www.arrow.com/en/products/rc0805fr-07560rl/yageo?region=nac
SCKT_FOR_U1 = 4828-3004-CP: IC Socket, DIP28, 28 Contact(s), 2.54mm Term Pitch, 7.62mm Row Spacing, Solder; Manufacturer_Name: 3M; Datasheet Link: http://multimedia.3m.com/mws/media/218496O/3mtm-dip-socket-4800-series-ts1099.pdf; Height: 5.207mm; Manufacturer_Part_Number: 4828-3004-CP; Mouser Part Number: 517-4828-3004-CP; Mouser Price/Stock: https://www.mouser.co.uk/ProductDetail/3M-Electronic-Solutions-Division/4828-3004-CP?qs=mroHWPoUHBolYNJsg4b2PQ%3D%3D; Arrow Part Number: 4828-3004-CP; Arrow Price/Stock: https://www.arrow.com/en/products/4828-3004-cp/3m?utm_currency=USD&region=nac
SW1 SW2 = 1825910-6: Switch; Manufacturer_Name: TE Connectivity; Datasheet Link: https://www.te.com/commerce/DocumentDelivery/DDEController?Action=srchrtrv&DocNm=1308111-1_SWITCHES_CORE_PROGRAM_CATALOG&DocType=Catalog%20Section&DocLang=English&PartCntxt=1825910-6&DocFormat=pdf; Height: 5.3mm; Manufacturer_Part_Number: 1825910-6; Mouser Part Number: 650-1825910-6; Mouser Price/Stock: https://www.mouser.co.uk/ProductDetail/TE-Connectivity/1825910-6?qs=A6cQTCBcXncisYDS1KbpGA%3D%3D; Arrow Part Number: 1825910-6; Arrow Price/Stock: https://www.arrow.com/en/products/1825910-6/te-connectivity?utm_currency=USD&region=europe
U1 = ATMEGA16U2-AU: Risc Microcontroller, 8-BIT, Flash, AVR Risc Cpu, 16MHZ, Cmos, PQFP32; Manufacturer: Microchip; Data Bus Width: 8b; Interface: SPI, Serial, UART, USART, USB; Max Supply Voltage: 5.5V; Memory Size: 16kB; Min Supply Voltage: 2.7V; Number of I/Os: 22; Number of PWM Channels: 5; Number of SPI Channels: 1; Number of Timers/Counters: 2; Oscillator Type: Internal; Peripherals: Brown-out Detect/Reset, POR, PWM, WDT; RAM Size: 512B; Watchdog Timer: Yes; Supplier 1: DigiKey; Manufacturer Part Number: ATMEGA16U2-AU; RoHS: Compliant; Category: Microcontrollers; Stock 1: 26602; Pricing 1: 1=3.24, 25=2.97, 100=2.7 (USD); Projected EOL Date: 2039-11-08; Case/Package: TQFP; Contact Plating: Tin; Core Architecture: AVR; Country of Assembly: Philippines; Country of Fabrication: United States of America; Country of Origin: Philippines; Export Control Classification Number (ECCN) Code: EAR99; Frequency: 16MHz; Height: 1.05mm; Harmonized Tariff Schedule (HTS) Code: 8542.31.0015; Lead Free: Lead Free; Length: 7mm; Lifecycle Status: Production; Max Frequency: 16MHz; Max Operating Temperature: 85°C; Memory Type: FLASH; Min Operating Temperature: -40°C; Mount: Surface Mount; Number of Pins: 32; Number of Programmable I/O: 22; REACH SVHC: No; Schedule B: 8542310000, 8542310000|8542310000|8542310000|8542310000|8542310000|8542310000|8542310000|8542310000|8542310000|8542310000|8542310000|8542310000|8542310000|8542310000|8542310000|8542310000|8542310000|8542310000|8542310000|8542310000|8542310000|8542310000|8542310000|85; Width: 7mm; ComponentLink1URL: https://datasheet.octopart.com:443/ATMEGA16U2-AU-Microchip-datasheet-14435305.pdf?src-supplier=LKR; ComponentLink1Description: https://datasheet.octopart.com:443/ATMEGA16U2-AU-Microchip-datasheet-14435305.pdf?src-supplier=LKR; ComponentLink2URL: https://datasheet.octopart.com:443/ATMEGA16U2-AU-Microchip-datasheet-13413706.pdf?src-supplier=Farnell; ComponentLink2Description: https://datasheet.octopart.com:443/ATMEGA16U2-AU-Microchip-datasheet-13413706.pdf?src-supplier=Farnell; ComponentLink3URL: https://datasheet.octopart.com:443/ATMEGA16U2-AU-Microchip-datasheet-175858400.pdf?src-supplier=Microchip; ComponentLink3Description: https://datasheet.octopart.com:443/ATMEGA16U2-AU-Microchip-datasheet-175858400.pdf?src-supplier=Microchip; ComponentLink4URL: https://datasheet.octopart.com:443/ATMEGA16U2-AU-Atmel-datasheet-24967522.pdf?src-supplier=Newark; ComponentLink4Description: https://datasheet.octopart.com:443/ATMEGA16U2-AU-Atmel-datasheet-24967522.pdf?src-supplier=Newark; ComponentLink5URL: https://datasheet.octopart.com:443/ATMEGA16U2-AU-Atmel-datasheet-10031542.pdf?src-supplier=_legacy+Avnet; ComponentLink5Description: https://datasheet.octopart.com:443/ATMEGA16U2-AU-Atmel-datasheet-10031542.pdf?src-supplier=_legacy+Avnet; ComponentLink6URL: https://datasheet.octopart.com:443/ATMEGA16U2-AU-Atmel-datasheet-8702439.pdf?src-supplier=_legacy+Avnet; ComponentLink6Description: https://datasheet.octopart.com:443/ATMEGA16U2-AU-Atmel-datasheet-8702439.pdf?src-supplier=_legacy+Avnet; ComponentLink7URL: https://datasheet.octopart.com:443/ATMEGA16U2-AU-Atmel-datasheet-8367484.pdf?src-supplier=_legacy+Avnet; ComponentLink7Description: https://datasheet.octopart.com:443/ATMEGA16U2-AU-Atmel-datasheet-8367484.pdf?src-supplier=_legacy+Avnet; ComponentLink8URL: http://sigma.octopart.com:80/188450247/materials_sheet/Microchip-ATMEGA16U2-AU.pdf?src-supplier=Compliance+Statements; ComponentLink8Description: http://sigma.octopart.com:80/188450247/materials_sheet/Microchip-ATMEGA16U2-AU.pdf?src-supplier=Compliance+Statements; ComponentLink9URL: http://sigma.octopart.com:80/conflict_mineral_statement/Microchip-company-68.pdf?src-supplier=Compliance+Statements; ComponentLink9Description: http://sigma.octopart.com:80/conflict_mineral_statement/Microchip-company-68.pdf?src-supplier=Compliance+Statements; ComponentLink10URL: http://sigma.octopart.com:80/conflict_mineral_statement/Microchip-company-69.pdf?src-supplier=Compliance+Statements; ComponentLink10Description: http://sigma.octopart.com:80/conflict_mineral_statement/Microchip-company-69.pdf?src-supplier=Compliance+Statements; ComponentLink11URL: http://sigma.octopart.com:80/reach_statement/Microchip-company-70.pdf?src-supplier=Compliance+Statements; ComponentLink11Description: http://sigma.octopart.com:80/reach_statement/Microchip-company-70.pdf?src-supplier=Compliance+Statements; ComponentLink12URL: http://sigma.octopart.com:80/rohs_statement/Microchip-company-71.pdf?src-supplier=Compliance+Statements; ComponentLink12Description: http://sigma.octopart.com:80/rohs_statement/Microchip-company-71.pdf?src-supplier=Compliance+Statements; ComponentLink13URL: http://sigma.octopart.com:80/rohs_statement/Atmel-company-4.pdf?src-supplier=Compliance+Statements; ComponentLink13Description: http://sigma.octopart.com:80/rohs_statement/Atmel-company-4.pdf?src-supplier=Compliance+Statements; ComponentLink14URL: http://sigma.octopart.com:80/rohs_statement/Atmel-company-5.pdf?src-supplier=Compliance+Statements; ComponentLink14Description: http://sigma.octopart.com:80/rohs_statement/Atmel-company-5.pdf?src-supplier=Compliance+Statements; ComponentLink15URL: http://sigma.octopart.com:80/reach_statement/Atmel-company-6.pdf?src-supplier=Compliance+Statements; ComponentLink15Description: http://sigma.octopart.com:80/reach_statement/Atmel-company-6.pdf?src-supplier=Compliance+Statements; Supplier Part Number 1: ATMEGA16U2-AU-ND
U2 = TL1963A-33DCQR: Integrated Circuit; Manufacturer_Name: Texas Instruments; Datasheet Link: http://www.ti.com/lit/gpn/tl1963a; Height: 1.8mm; Manufacturer_Part_Number: TL1963A-33DCQR; Mouser Part Number: 595-TL1963A-33DCQR; Mouser Price/Stock: https://www.mouser.co.uk/ProductDetail/Texas-Instruments/TL1963A-33DCQR?qs=IK5e5L0zOXjAWPSeckRG3g%3D%3D; Arrow Part Number: TL1963A-33DCQR; Arrow Price/Stock: https://www.arrow.com/en/products/tl1963a-33dcqr/texas-instruments?utm_currency=USD&region=nac
U3 = ATMEGA328P-PU: Microchip - ATMEGA328P-PU - Microcontroller Mcu, 8 Bit, Atmega, 20MHZ, DIP-28; Core Architecture: AVR; Data Bus Width: 8b; Interface: 2-Wire, I2C, SPI, UART, USART; Max Supply Voltage: 5.5V; Memory Size: 32kB; Memory Type: FLASH; Min Supply Voltage: 1.8V; Number of ADC Channels: 6; Number of I2C Channels: 1; Number of I/Os: 23; Number of Timers/Counters: 3; Oscillator Type: Internal; Peripherals: Brown-out Detect/Reset, POR, PWM, WDT; RAM Size: 2kB; Watchdog Timer: Yes; Supplier 1: DigiKey; Manufacturer: Microchip; Manufacturer Part Number: ATMEGA328P-PU; RoHS: Compliant; Category: Microcontrollers; Stock 1: 57086; Pricing 1: 1=2.89, 25=2.65, 100=2.39 (USD); Projected EOL Date: 2039-11-04; Case/Package: PDIP; Contact Plating: Tin; Country of Assembly: Thailand; Country of Fabrication: United States of America; Country of Origin: Thailand; Export Control Classification Number (ECCN) Code: EAR99; Frequency: 20MHz; Height: 3.28mm; Harmonized Tariff Schedule (HTS) Code: 8542.31.0015; Lead Free: Lead Free; Length: 37.4mm; Lifecycle Status: Production; Max Frequency: 20MHz; Max Operating Temperature: 85°C; Min Operating Temperature: -40°C; Mount: Through Hole; Number of Pins: 28; Number of Programmable I/O: 23; Number of PWM Channels: 6; Number of SPI Channels: 1; Radiation Hardening: No; REACH SVHC: No; Schedule B: 8542310000, 8542310000|8542310000|8542310000|8542310000|8542310000; Width: 6.76mm; ComponentLink1URL: https://datasheet.octopart.com:443/ATMEGA328P-PU-Atmel-datasheet-34147914.pdf?src-supplier=Upverter; ComponentLink1Description: https://datasheet.octopart.com:443/ATMEGA328P-PU-Atmel-datasheet-34147914.pdf?src-supplier=Upverter; ComponentLink2URL: https://datasheet.octopart.com:443/ATMEGA328P-PU-Microchip-datasheet-14421303.pdf?src-supplier=Upverter; ComponentLink2Description: https://datasheet.octopart.com:443/ATMEGA328P-PU-Microchip-datasheet-14421303.pdf?src-supplier=Upverter; ComponentLink3URL: https://datasheet.octopart.com:443/ATMEGA328P-PU-Atmel-datasheet-14353408.pdf?src-supplier=Upverter; ComponentLink3Description: https://datasheet.octopart.com:443/ATMEGA328P-PU-Atmel-datasheet-14353408.pdf?src-supplier=Upverter; ComponentLink4URL: https://datasheet.octopart.com:443/ATMEGA328P-PU-Microchip-datasheet-68295846.pdf?src-supplier=SHENGYU+ELECTRONICS; ComponentLink4Description: https://datasheet.octopart.com:443/ATMEGA328P-PU-Microchip-datasheet-68295846.pdf?src-supplier=SHENGYU+ELECTRONICS; ComponentLink5URL: https://datasheet.octopart.com:443/ATMEGA328P-PU-Microchip-datasheet-133520744.pdf?src-supplier=LKR; ComponentLink5Description: https://datasheet.octopart.com:443/ATMEGA328P-PU-Microchip-datasheet-133520744.pdf?src-supplier=LKR; ComponentLink6URL: https://datasheet.octopart.com:443/ATMEGA328P-PU-Microchip-datasheet-62316222.pdf?src-supplier=element14+APAC; ComponentLink6Description: https://datasheet.octopart.com:443/ATMEGA328P-PU-Microchip-datasheet-62316222.pdf?src-supplier=element14+APAC; ComponentLink7URL: https://datasheet.octopart.com:443/ATMEGA328P-PU-Atmel-datasheet-13381135.pdf?src-supplier=element14+APAC; ComponentLink7Description: https://datasheet.octopart.com:443/ATMEGA328P-PU-Atmel-datasheet-13381135.pdf?src-supplier=element14+APAC; ComponentLink8URL: https://datasheet.octopart.com:443/ATMEGA328P-PU-Microchip-datasheet-147334532.pdf?src-supplier=Microchip; ComponentLink8Description: https://datasheet.octopart.com:443/ATMEGA328P-PU-Microchip-datasheet-147334532.pdf?src-supplier=Microchip; ComponentLink9URL: https://datasheet.octopart.com:443/ATMEGA328P-PU-Microchip-datasheet-148646239.pdf?src-supplier=Microchip; ComponentLink9Description: https://datasheet.octopart.com:443/ATMEGA328P-PU-Microchip-datasheet-148646239.pdf?src-supplier=Microchip; ComponentLink10URL: https://datasheet.octopart.com:443/ATMEGA328P-PU-Microchip-datasheet-154741723.pdf?src-supplier=Electro+Sonic; ComponentLink10Description: https://datasheet.octopart.com:443/ATMEGA328P-PU-Microchip-datasheet-154741723.pdf?src-supplier=Electro+Sonic; ComponentLink11URL: https://datasheet.octopart.com:443/ATMEGA328P-PU-Microchip-datasheet-100453898.pdf?src-supplier=Burklin+Elektronik; ComponentLink11Description: https://datasheet.octopart.com:443/ATMEGA328P-PU-Microchip-datasheet-100453898.pdf?src-supplier=Burklin+Elektronik; ComponentLink12URL: https://datasheet.octopart.com:443/ATMEGA328P-PU-Atmel-datasheet-30457899.pdf?src-supplier=Seeed+Studio; ComponentLink12Description: https://datasheet.octopart.com:443/ATMEGA328P-PU-Atmel-datasheet-30457899.pdf?src-supplier=Seeed+Studio; ComponentLink13URL: https://datasheet.octopart.com:443/ATMEGA328P-PU-Microchip-datasheet-10842036.pdf?src-supplier=SOS+electronic; ComponentLink13Description: https://datasheet.octopart.com:443/ATMEGA328P-PU-Microchip-datasheet-10842036.pdf?src-supplier=SOS+electronic; ComponentLink14URL: https://datasheet.octopart.com:443/ATMEGA328P-PU-Microchip-datasheet-8364063.pdf?src-supplier=Jameco; ComponentLink14Description: https://datasheet.octopart.com:443/ATMEGA328P-PU-Microchip-datasheet-8364063.pdf?src-supplier=Jameco; ComponentLink15URL: https://datasheet.octopart.com:443/ATMEGA328P-PU-Microchip-datasheet-154323124.pdf?src-supplier=Jameco; ComponentLink15Description: https://datasheet.octopart.com:443/ATMEGA328P-PU-Microchip-datasheet-154323124.pdf?src-supplier=Jameco; ComponentLink16URL: https://datasheet.octopart.com:443/ATMEGA328P-PU-Atmel-datasheet-10389530.pdf?src-supplier=Newark; ComponentLink16Description: https://datasheet.octopart.com:443/ATMEGA328P-PU-Atmel-datasheet-10389530.pdf?src-supplier=Newark; ComponentLink17URL: https://datasheet.octopart.com:443/ATMEGA328P-PU-Microchip-datasheet-65729177.pdf?src-supplier=TME; ComponentLink17Description: https://datasheet.octopart.com:443/ATMEGA328P-PU-Microchip-datasheet-65729177.pdf?src-supplier=TME; ComponentLink18URL: https://datasheet.octopart.com:443/ATMEGA328P-PU-Microchip-datasheet-101746195.pdf?src-supplier=Future+Electronics; ComponentLink18Description: https://datasheet.octopart.com:443/ATMEGA328P-PU-Microchip-datasheet-101746195.pdf?src-supplier=Future+Electronics; ComponentLink19URL: http://sigma.octopart.com:80/188450569/materials_sheet/Microchip-ATMEGA328P-PU.pdf?src-supplier=Compliance+Statements; ComponentLink19Description: http://sigma.octopart.com:80/188450569/materials_sheet/Microchip-ATMEGA328P-PU.pdf?src-supplier=Compliance+Statements; ComponentLink20URL: http://sigma.octopart.com:80/conflict_mineral_statement/Microchip-company-68.pdf?src-supplier=Compliance+Statements; ComponentLink20Description: http://sigma.octopart.com:80/conflict_mineral_statement/Microchip-company-68.pdf?src-supplier=Compliance+Statements; ComponentLink21URL: http://sigma.octopart.com:80/conflict_mineral_statement/Microchip-company-69.pdf?src-supplier=Compliance+Statements; ComponentLink21Description: http://sigma.octopart.com:80/conflict_mineral_statement/Microchip-company-69.pdf?src-supplier=Compliance+Statements; ComponentLink22URL: http://sigma.octopart.com:80/reach_statement/Microchip-company-70.pdf?src-supplier=Compliance+Statements; ComponentLink22Description: http://sigma.octopart.com:80/reach_statement/Microchip-company-70.pdf?src-supplier=Compliance+Statements; ComponentLink23URL: http://sigma.octopart.com:80/rohs_statement/Microchip-company-71.pdf?src-supplier=Compliance+Statements; ComponentLink23Description: http://sigma.octopart.com:80/rohs_statement/Microchip-company-71.pdf?src-supplier=Compliance+Statements; ComponentLink24URL: http://sigma.octopart.com:80/rohs_statement/Atmel-company-4.pdf?src-supplier=Compliance+Statements; ComponentLink24Description: http://sigma.octopart.com:80/rohs_statement/Atmel-company-4.pdf?src-supplier=Compliance+Statements; ComponentLink25URL: http://sigma.octopart.com:80/rohs_statement/Atmel-company-5.pdf?src-supplier=Compliance+Statements; ComponentLink25Description: http://sigma.octopart.com:80/rohs_statement/Atmel-company-5.pdf?src-supplier=Compliance+Statements; ComponentLink26URL: http://sigma.octopart.com:80/reach_statement/Atmel-company-6.pdf?src-supplier=Compliance+Statements; ComponentLink26Description: http://sigma.octopart.com:80/reach_statement/Atmel-company-6.pdf?src-supplier=Compliance+Statements; Supplier Part Number 1: ATMEGA328P-PU-ND
U4-U7 = SN74AHC1G09DBVR: Integrated Circuit; Manufacturer_Name: Texas Instruments; Datasheet Link: http://www.ti.com/lit/gpn/sn74ahc1g09; Height: 1.45mm; Manufacturer_Part_Number: SN74AHC1G09DBVR; Mouser Part Number: 595-SN74AHC1G09DBVR; Mouser Price/Stock: https://www.mouser.co.uk/ProductDetail/Texas-Instruments/SN74AHC1G09DBVR?qs=SMj%252Bbyv09TwoyWK2f6L9Mg%3D%3D; Arrow Part Number: SN74AHC1G09DBVR; Arrow Price/Stock: https://www.arrow.com/en/products/sn74ahc1g09dbvr/texas-instruments?region=nac
Y1 Y2 = ABM7-16.000MHZ-D2Y-T: Crystal or Oscillator; Manufacturer_Name: ABRACON; Datasheet Link: https://abracon.com/Resonators/abm7.pdf; Height: 1.4mm; Manufacturer_Part_Number: ABM7-16.000MHZ-D2Y-T; Mouser Part Number: 815-ABM7-16-D2Y-T; Mouser Price/Stock: https://www.mouser.co.uk/ProductDetail/ABRACON/ABM7-16.000MHZ-D2Y-T?qs=LoTOQoUkC8QdlhlqgnS4cw%3D%3D; Arrow Part Number: ABM7-16.000MHZ-D2Y-T; Arrow Price/Stock: https://www.arrow.com/en/products/abm7-16.000mhz-d2y-t/abracon?utm_currency=USD&region=nac
Z1 Z2 = CG0603MLC-05E: Varistor, 8 V, 5 V, ChipGuard MLC, 20 V, 0603 [1608 Metric], Multilayer Varistor (MLV); Manufacturer_Name: Bourns; Datasheet Link: http://www.farnell.com/datasheets/1785244.pdf; Height: 0.55mm; Manufacturer_Part_Number: CG0603MLC-05E; Mouser Part Number: 652-CG0603MLC-05E; Mouser Price/Stock: https://www.mouser.co.uk/ProductDetail/Bourns/CG0603MLC-05E?qs=lDok7oSghXVLNKMK69q%252BFQ%3D%3D; Arrow Part Number: CG0603MLC-05E; Arrow Price/Stock: https://www.arrow.com/en/products/cg0603mlc-05e/bourns?utm_currency=USD&region=nac